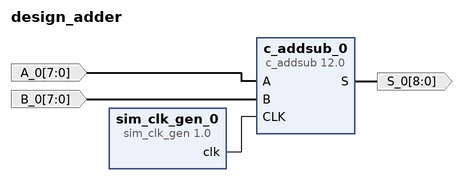
[diagram p0: block diagram of the top level]
# Vivado block design design_adder, xc7a35tcpg236-2L, Vivado 2023.1
create_bd_design design_adder

create_bd_port -dir I -from 7 -to 0 -type data A_0
create_bd_port -dir I -from 7 -to 0 -type data B_0
create_bd_port -dir O -from 8 -to 0 -type data S_0

create_bd_cell -type ip -vlnv xilinx.com:ip:c_addsub:12.0 c_addsub_0
set_property -dict [list \
  CONFIG.A_Type Unsigned \
  CONFIG.A_Width 8 \
  CONFIG.B_Type Unsigned \
  CONFIG.B_Value 00000000 \
  CONFIG.B_Width 8 \
  CONFIG.CE false \
  CONFIG.Latency 1 \
  CONFIG.Out_Width 9 \
] [get_bd_cells c_addsub_0]
create_bd_cell -type ip -vlnv xilinx.com:ip:sim_clk_gen:1.0 sim_clk_gen_0

# ---- connections ----

connect_bd_net -net A_0_1 [get_bd_ports A_0] [get_bd_pins c_addsub_0/A]
connect_bd_net -net B_0_1 [get_bd_ports B_0] [get_bd_pins c_addsub_0/B]
connect_bd_net [get_bd_pins c_addsub_0/S] [get_bd_ports S_0]
connect_bd_net [get_bd_pins sim_clk_gen_0/clk] [get_bd_pins c_addsub_0/CLK]

validate_bd_design
save_bd_design
